# Altium schematic sheet adc_dac_main6.SchDoc: mcHF QRP Transceiver UI board
size A4; Author: K Atanassov; CompanyName: M0NKA; Revision: 0.6.3; SheetTotal: 5
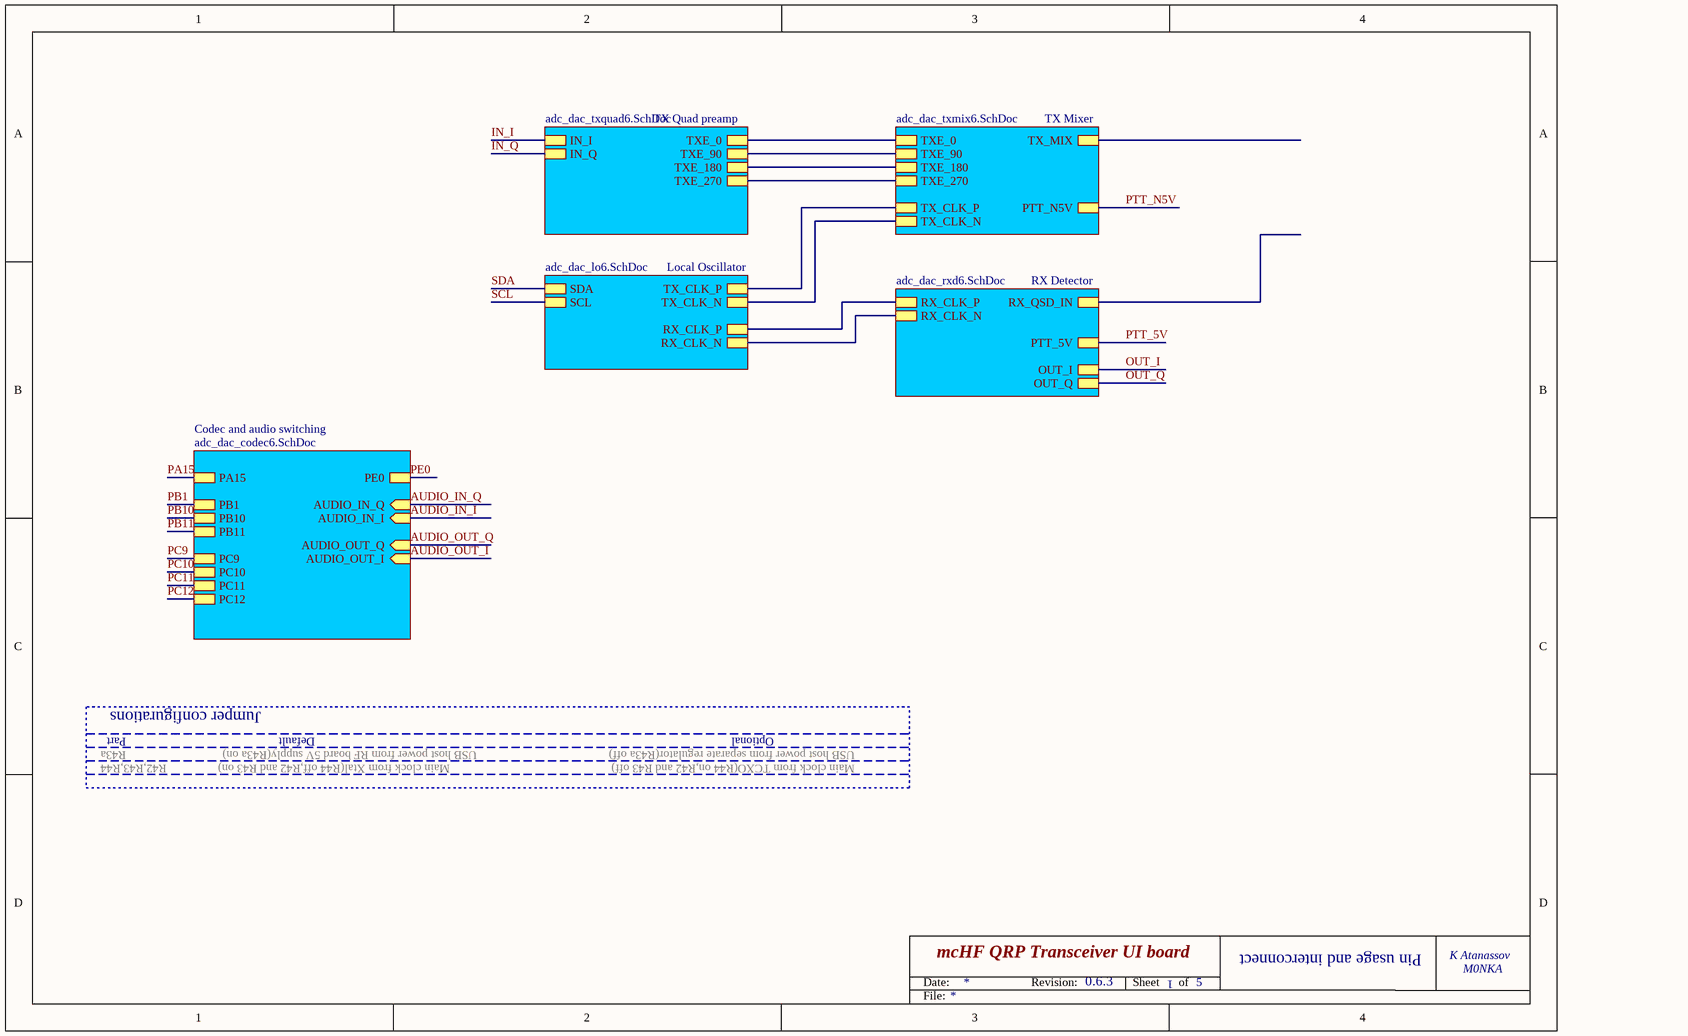
[diagram p0: adc_dac_main6.SchDoc]

## Sub-sheets
Codec and audio switching = adc_dac_codec6.SchDoc: PA15, PB1, PB10, PB11, PC9, PC11, PC10, PC12, PE0, AUDIO_IN_Q (in), AUDIO_IN_I (in), AUDIO_OUT_Q (in), AUDIO_OUT_I (in)
Local Oscillator = adc_dac_lo6.SchDoc: SDA, SCL, RX_CLK_N, RX_CLK_P, TX_CLK_P, TX_CLK_N
RX Detector = adc_dac_rxd6.SchDoc: RX_QSD_IN, OUT_I, OUT_Q, PTT_5V, RX_CLK_N, RX_CLK_P
TX Mixer = adc_dac_txmix6.SchDoc: PTT_N5V, TX_MIX, TXE_270, TXE_180, TXE_90, TXE_0, TX_CLK_P, TX_CLK_N
TX Quad preamp = adc_dac_txquad6.SchDoc: IN_I, IN_Q, TXE_0, TXE_90, TXE_180, TXE_270

## Nets
AUDIO_IN_I: sheet Codec and audio switching/AUDIO_IN_I
AUDIO_IN_Q: sheet Codec and audio switching/AUDIO_IN_Q
AUDIO_OUT_I: sheet Codec and audio switching/AUDIO_OUT_I
AUDIO_OUT_Q: sheet Codec and audio switching/AUDIO_OUT_Q
IN_I: sheet TX Quad preamp/IN_I
IN_Q: sheet TX Quad preamp/IN_Q
OUT_I: sheet RX Detector/OUT_I
OUT_Q: sheet RX Detector/OUT_Q
PA15: sheet Codec and audio switching/PA15
PB1: sheet Codec and audio switching/PB1
PB10: sheet Codec and audio switching/PB10
PB11: sheet Codec and audio switching/PB11
PC9: sheet Codec and audio switching/PC9
PC10: sheet Codec and audio switching/PC10
PC11: sheet Codec and audio switching/PC11
PC12: sheet Codec and audio switching/PC12
PE0: sheet Codec and audio switching/PE0
PTT_5V: sheet RX Detector/PTT_5V
PTT_N5V: sheet TX Mixer/PTT_N5V
SCL: sheet Local Oscillator/SCL
SDA: sheet Local Oscillator/SDA
(unnamed): sheet TX Quad preamp/TXE_0, sheet TX Mixer/TXE_0
(unnamed): sheet TX Quad preamp/TXE_90, sheet TX Mixer/TXE_90
(unnamed): sheet TX Quad preamp/TXE_180, sheet TX Mixer/TXE_180
(unnamed): sheet TX Quad preamp/TXE_270, sheet TX Mixer/TXE_270
(unnamed): sheet RX Detector/RX_CLK_N, sheet Local Oscillator/RX_CLK_N
(unnamed): sheet RX Detector/RX_CLK_P, sheet Local Oscillator/RX_CLK_P
(unnamed): sheet Local Oscillator/TX_CLK_P, sheet TX Mixer/TX_CLK_P
(unnamed): sheet Local Oscillator/TX_CLK_N, sheet TX Mixer/TX_CLK_N

## Notes on the sheet
- Jumper configurations
- Part
- R43a
- R42,R43,R44
- Default
- Main clock from Xtal(R44 off,R42 and R43 on)
- USB host power from RF board 5V supply(R43a on)
- Optional
- USB host power from separate regulator(R43a off)
- Main clock from TCXO(R44 on,R42 and R43 off)
- 1
- Pin usage and interconnect
- Date:
- Revision:
- Sheet
- of
- File: